# Altium project HVD F32.PrjPcb (part 1 of 2)
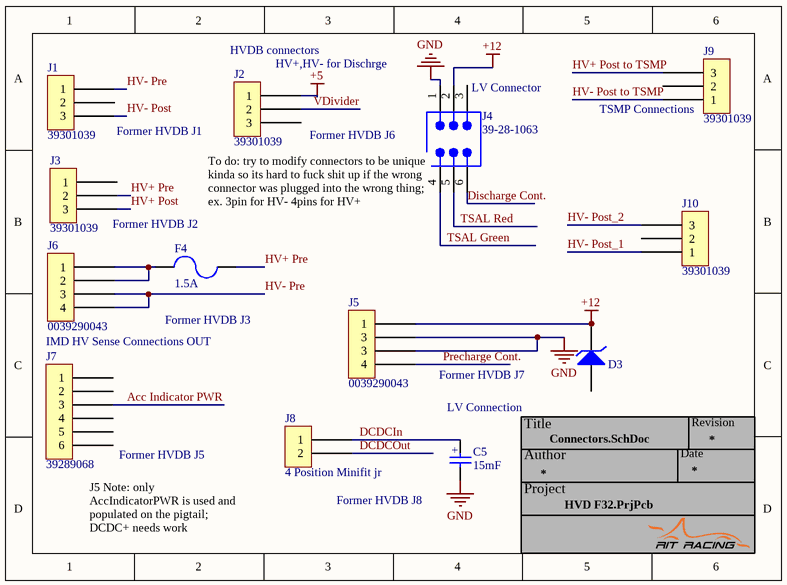
[diagram p0: Connectors.SchDoc]
4 sheets, 123 parts. Net scope: global (net labels, ports and power ports of the same name join across sheets).
Sheets:
  Connectors.SchDoc
  HVD.SchDoc
  external hvd schematic.SchDoc
  TSAL.SchDoc

## Sheet Connectors.SchDoc
size 146 x 107 mm; SheetNumber: 1; SheetTotal: 4

### Parts
(Parts that share a designator on the sheet are numbered #1, #2 ... from top to bottom, then left to right.)
C5#1  15mF  [158KXM050M]
D3  (no value)  [DO-214AC]
F4  1.5A  [048501.5DR]
J1  39301039  [39301039]
J2  39301039  [39301039]
J3  39301039  [39301039]
J4  39-28-1063  [MOLX-39-28-1063_V]
J5  0039290043  [0039290043]
J6  0039290043  [0039290043]
J7  39289068  [39289068]
J8  4 Position Minifit jr  [0010845040]
J9  39301039  [39301039]
J10  39301039  [39301039]

### Nets
+5: J2.1
+12: D3.2(K) J4.2 J5.1
GND: C5#1.2(Neg) J4.1 J5.2(3) J5.3
HV- Post: J1.3
HV- Post_1: J10.1
Acc Indicator PWR: J7.3
DCDCIn: C5#1.1(Pos) J8.1
DCDCOut: J8.2
Discharge Cont.: J4.6
HV+ Post: J3.3
HV+ Post to TSMP: J9.3
HV+ Pre: F4.2 J3.2
HV- Post to TSMP: J9.1
HV- Post_2: J10.3
HV- Pre: J1.1 J6.3 J6.4
Precharge Cont.: J5.4
TSAL Green: J4.4
TSAL Red: J4.5
VDivider: J2.2
NetF4_1: F4.1 J6.1 J6.2

Not connected (* = marked no-connect by the designer): D3 1(A); J1 2; J2 3; J3 1; J4 3; J7 1 2 4 5 6; J9 2; J10 2

### Notes on the sheet
- (near J2) HVDB connectors
- (near J2) HV+,HV- for Dischrge
- Former HVDB J1
- (near J4) LV Connector
- (near J9) TSMP Connections
- Former HVDB J6
- Former HVDB J2
- (near J4) To do: try to modify connectors to be unique kinda so its hard to fuck shit up if the wrong connector was plugged into the wrong thing; ex. 3pin for HV- 4pins for HV+
- (near F4) Former HVDB J3
- IMD HV Sense Connections OUT
- Former HVDB J7
- (near J7) Former HVDB J5
- (near C5#1) LV Connection
- Former HVDB J8
- (near J7) J5 Note: only AccIndicatorPWR is used and populated on the pigtail; DCDC+ needs work
- Title
- Author
- Date
- Revision
- Project
- (in symbol 158KXM050M) +

### Library data of the parts
C5#1 = 158KXM050M: 1.5mF Electrolytic
D3 = SMAJ16A: TVS Diode, SMD Mount, 16V Withstand, 17.8V Breakdown, 400W; TargetLibrary: RITRacing-Passives; MFG: Littlefuse; Publisher: T.Tallo; Published: 22Oct2016; Status: Active; PartNumber: SMAJ16A
F4 = 048501.5DR: 1.5A 600VDC Fuse, SMD Mount; Manufactuer: Littlefuse; TargetLibrary: RITRacing-Passives; Value: Value?; Publisher: T.Tallo; Published: 22Oct2016; Status: Active; Datasheet: https://www.littelfuse.com/~/media/electronics/datasheets/fuses/littelfuse_fuse_485_datasheet.pdf.pdf; Part Number: 048501.5DR
J1-J3 J9 J10 = 39301039: 3 Pin Minifit vertical
  J9: Supplier 1: Digi-Key; Supplier Part Number 1: WM18442-ND
J4 = CMP-1594-00001-1: 4.2 mm Pitch Mini-Fit Jr.Power Connector, Vertical, Through Hole, 6 Circuits, -40 to 105 degC, RoHS, Bag; Pitch: 4.2 mm; No. of Positions: 6; No. of Rows: 2; PartNumber: 39-28-1063; ComponentLink3Description: Package Specification; ComponentLink1URL: http://www.molex.com/; PackageVersion: Rev. F, 06/2009; Orientation: Vertical; ComponentLink3URL: http://www.molex.com/pdm_docs/sd/039281063_sd.pdf; ComponentLink2Description: Datasheet; PackageDescription: 6-Pin PCB Header, Vertical, Pitch 4.2 mm, Through Hole; ComponentLink1Description: Manufacturer URL; Temperature Min: -40 degC; RoHS: TRUE; Packing: Bag; Mounting Technology: Through Hole; Temperature Max: 105 degC; ComponentLink2URL: http://www.molex.com/webdocs/datasheets/pdf/en-us/0039281063_PCB_HEADERS.pdf
J5 J6 = 0039290043: Minifit jr 4 position
J8 = 0010845040

## Sheet HVD.SchDoc
size Letter; SheetNumber: 2; SheetTotal: 4
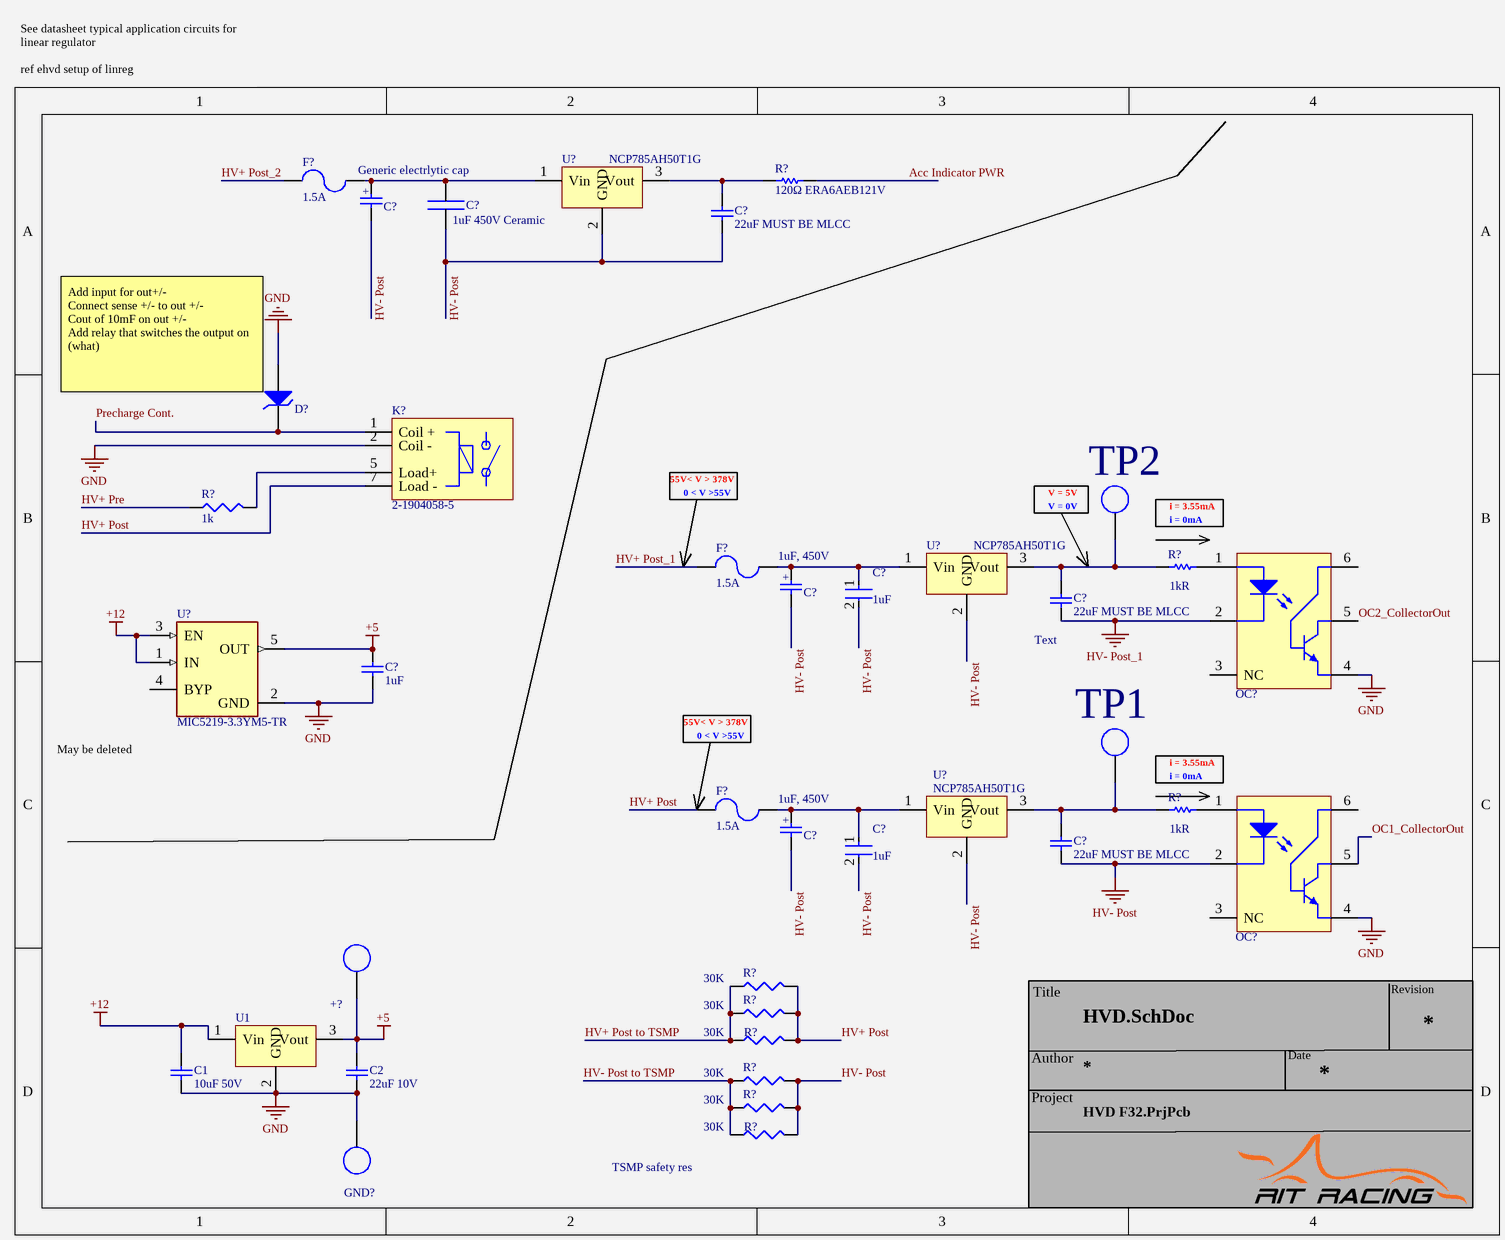
[diagram p1: HVD.SchDoc]

### Parts
(Parts that share a designator on the sheet are numbered #1, #2 ... from top to bottom, then left to right.)
+?  N/A  [PCB Test Point]  (value not drawn)
C1  10uF 50V  [CAPC2013X145X50LL20T25]
C2  22uF 10V  [CAPC2013X145X50LL20T25]
C?#1  Generic electrlytic cap  [Cap, TH, Electrolytic, 450V]
C?#2  1uF 450V Ceramic  [C5750X7T2W105K250KA]
C?#3  22uF MUST BE MLCC  [CAPC2013X145X50LL20T25]
C?#4  Capacitance: 1uF  [FP-GRM55D-0_4-IPC_A]  (hidden comment: 2220Y5000105KXTWS2)
C?#5  1uF, 450V  [Cap, TH, Electrolytic, 450V]
C?#6  22uF MUST BE MLCC  [CAPC2013X145X50LL20T25]
C?#7  1uF  [Cap, TH, Electrolytic]
C?#8  1uF, 450V  [Cap, TH, Electrolytic, 450V]
C?#9  Capacitance: 1uF  [FP-GRM55D-0_4-IPC_A]  (hidden comment: 2220Y5000105KXTWS2)
C?#10  22uF MUST BE MLCC  [CAPC2013X145X50LL20T25]
D?  (no value)  [DO-214AC]
F?#1  1.5A  [048501.5DR]
F?#2  1.5A  [048501.5DR]
F?#3  1.5A  [048501.5DR]
GND?  N/A  [PCB Test Point]  (value not drawn)
K?  2-1904058-5  [2-1904058-5]
OC?#1  CNY17-1  [DIP6]  (value not drawn)
OC?#2  CNY17-1  [DIP6]  (value not drawn)
R?#1  120Ω ERA6AEB121V  [RESC2013X60X40ML20T25]
R?#2  1k  [25W Wirewound Resistor, Chassis Mount]
R?#3  value 1kR  [RESC2013X70X40ML20T20]  (hidden comment: ERJ-6GEYJ102V)
R?#4  value 1kR  [RESC2013X70X40ML20T20]  (hidden comment: ERJ-6GEYJ102V)
R?#5  30K  [5329]
R?#6  30K  [5329]
R?#7  30K  [5329]
R?#8  30K  [5329]
R?#9  30K  [5329]
R?#10  30K  [5329]
TP1#1  N/A  [PCB Test Point]  (value not drawn)
TP2#1  N/A  [PCB Test Point]  (value not drawn)
U1  VXO7805-1000  [VXO7805-1000]  (value not drawn)
U?#1  NCP785AH50T1G  [SOT89]
U?#2  NCP785AH50T1G  [SOT89]
U?#3  MIC5219-3.3YM5-TR  [FP-SOT23-5LD-PL-1-IPC_C]
U?#4  NCP785AH50T1G  [SOT89]

### Nets
+5: +?.1 C2.1 C?#7.2(Neg) U1.3(Vout) U?#3.5(OUT)
+12: C1.1 U1.1(Vin) U?#3.1(IN) U?#3.3(EN)
GND: C1.2 C2.2 C?#7.1(Pos) D?.1(A) GND?.1 K?.2(Coil_-) OC?#1.4 OC?#2.4 U1.2(GND) U?#3.2(GND)
HV- Post: C?#1.2(Neg) C?#2.2 C?#3.2 C?#4.2 C?#5.2(Neg) C?#8.2(Neg) C?#9.2 C?#10.2 OC?#2.2(C) R?#8.2 R?#9.2 R?#10.2 U?#1.2(GND) U?#2.2(GND) U?#4.2(GND)
HV- Post_1: C?#6.2 OC?#1.2(C)
Acc Indicator PWR: R?#1.2
HV+ Post: F?#3.1 K?.7(Load_-) R?#5.2 R?#6.2 R?#7.2
HV+ Post to TSMP: R?#5.1 R?#6.1 R?#7.1
HV+ Post_1: F?#2.1
HV+ Post_2: F?#1.1
HV+ Pre: R?#2.1
HV- Post to TSMP: R?#8.1 R?#9.1 R?#10.1
OC1_CollectorOut: OC?#2.5
OC2_CollectorOut: OC?#1.5
Precharge Cont.: D?.2(K) K?.1(Coil_+)
NetC?#1_1: C?#1.1(Pos) C?#2.1 F?#1.2 U?#1.1(Vin)
NetC?#3_1: C?#3.1 R?#1.1 U?#1.3(Vout)
NetC?#4_1: C?#4.1 C?#5.1(Pos) F?#2.2 U?#2.1(Vin)
NetC?#6_1: C?#6.1 R?#3.1 TP2#1.1 U?#2.3(Vout)
NetC?#8_1: C?#8.1(Pos) C?#9.1 F?#3.2 U?#4.1(Vin)
NetC?#10_1: C?#10.1 R?#4.1 TP1#1.1 U?#4.3(Vout)
NetK?_5: K?.5(Load+) R?#2.2
NetOC?#1_1: OC?#1.1(A) R?#3.2
NetOC?#2_1: OC?#2.1(A) R?#4.2

Not connected (* = marked no-connect by the designer): OC?#1 3(NC) 6(Base); OC?#2 3(NC) 6(Base); U?#3 4(BYP)

### Notes on the sheet
- See datasheet typical application circuits for linear regulator
  ref ehvd setup of linreg
- (near D?) Add input for out+/-
  Connect sense +/- to out +/-
  Cout of 10mF on out +/-
  Add relay that switches the output on
  (what)
- 55V< V > 378V
- 0 < V >55V
- (near TP2#1) V = 5V
- (near TP2#1) V = 0V
- i = 3.55mA
- i = 0mA
- (near C?#6) Text
- (near U?#3) May be deleted
- (near R?#10) TSMP safety res
- Revision
- Title
- Date
- Author
- Project
- (in symbol Cap, TH Electrolytic 450V) +

### Library data of the parts
+? GND? TP1#1 TP2#1 = PCB Test Point: Manufacturer: RIT Racing; TargetLibrary: RITRacing-Connectors; PartNumber: N/A; Publisher: T.Tallo; Published: 22Oct2016; Status: Active; ComponentLink1URL: http://www.mouser.com/ds/2/215/005-5009-743680.pdf; ComponentLink1Description: Datasheet
C1 = CMP-1036-04746-2: Generic SMD Cap, 0805 Package; Manufacturer: Kemet; Part Number: C0805C105K4PACTU; Manufacturer 1: Samsung; Manufacturer Part Number 1: CL21A106KOQNNNE; Voltage Rating: 16V; Tolerance: 10%; Dielectric: X7R; Supplier 1: Digi-Key; Supplier Part Number 1: 1276-1096-1-ND; RoHS: Yes; Category: Ceramic Capacitors; Stock 1: 5707600; Pricing 1: 1=0.10000, 10=0.07400, 50=0.04040, 100=0.03300, 500=0.02354, 1000=0.01850 (USD); Mounting Technology: Surface Mount; Case/Package: 0805; Case Code (Metric): 2012; Case Code (Imperial): 0805; Min Operating Temperature: -55°C; Max Operating Temperature: 85°C; Package Quantity: 1; Packaging: Tape and Reel; Series: CL; Value: 10uF; Voltage Rating (DC): 16V; Voltage: 16V; Construction: Flat; Length: 2mm; Width: 0.049inch; Height: 1.25mm; Thickness: 0.055inch; Depth: 1.25mm; Radiation Hardening: No; RoHS Compliant: Yes; Lead Free: Lead Free; ComponentLink1URL: https://datasheet.ciiva.com/25798/cl21a106koqnnne-25798133.pdf?src-supplier=Digi-Key; ComponentLink1Description: https://datasheet.ciiva.com/25798/cl21a106koqnnne-25798133.pdf?src-supplier=Digi-Key; ComponentLink2URL: https://datasheet.ciiva.com/15216/getdatasheetpartid-358435-15216234.pdf?src-supplier=Verical; ComponentLink2Description: https://datasheet.ciiva.com/15216/getdatasheetpartid-358435-15216234.pdf?src-supplier=Verical; ComponentLink3URL: https://datasheet.ciiva.com/16740/cl05b104kq5nnnc-16740697.pdf?src-supplier=Future+Electronics; ComponentLink3Description: https://datasheet.ciiva.com/16740/cl05b104kq5nnnc-16740697.pdf?src-supplier=Future+Electronics
C2 = CMP-1036-04746-2: Generic SMD Cap, 0805 Package; Manufacturer 1: TDK; Manufacturer Part Number 1: C2012X5R1C226M125AC; Dielectric Material: Ceramic; Tolerance: 20%; Voltage Rating: 16V; Dielectric: X5R; Supplier 1: Digi-Key; Supplier Part Number 1: 445-7647-1-ND; RoHS: Yes; Category: Ceramic Capacitors; Stock 1: 149468; Pricing 1: 1=0.59000, 10=0.41400, 50=0.31320, 100=0.27270, 500=0.20200, 1000=0.17170 (USD); Mounting Technology: Surface Mount; Case/Package: 0805; Pins: 2; Case Code (Metric): 2012; Case Code (Imperial): 0805; Weight: 0.000194oz; Min Operating Temperature: -55°C; Max Operating Temperature: 85°C; Value: 22uF; Packaging: Tape and Reel; Package Quantity: 1; Voltage Rating (DC): 16V; Termination: SMD/SMT; Resistor Type: Ceramic; Series: C; Construction: Flat; Length: 2mm; Width: 0.049inch; Height: 1.25mm; Thickness: 0.057inch; Depth: 1.25mm; Radiation Hardening: No; Lead Free: Lead Free; RoHS Compliant: Yes; ComponentLink1URL: https://datasheet.ciiva.com/6252/tdkmlcccaprange-6252728.pdf?src-supplier=Digi-Key; ComponentLink1Description: https://datasheet.ciiva.com/6252/tdkmlcccaprange-6252728.pdf?src-supplier=Digi-Key; ComponentLink2URL: https://datasheet.ciiva.com/6252/tdkmlcccaprange-6252730.pdf?src-supplier=Digi-Key; ComponentLink2Description: https://datasheet.ciiva.com/6252/tdkmlcccaprange-6252730.pdf?src-supplier=Digi-Key; ComponentLink3URL: https://datasheet.ciiva.com/6252/tdkmlcccaprange-6252732.pdf?src-supplier=Digi-Key; ComponentLink3Description: https://datasheet.ciiva.com/6252/tdkmlcccaprange-6252732.pdf?src-supplier=Digi-Key; ComponentLink4URL: https://datasheet.ciiva.com/22725/1913358-22725560.pdf?src-supplier=Element14; ComponentLink4Description: https://datasheet.ciiva.com/22725/1913358-22725560.pdf?src-supplier=Element14; ComponentLink5URL: https://datasheet.ciiva.com/16449/e412-c-16449593.pdf?src-supplier=Future+Electronics; ComponentLink5Description: https://datasheet.ciiva.com/16449/e412-c-16449593.pdf?src-supplier=Future+Electronics
C?#1 C?#5 C?#8 = Cap, TH Electrolytic 450V: 8mmx3.5mm
  C?#5 C?#8: Supplier 1: Digi-Key; Supplier Part Number 1: 493-13563-1-ND
C?#2 = C5750X7T2W105K250KA: 1uF 450V Ceramic 2220
C?#3 C?#6 C?#10 = CMP-1036-04746-2: Generic SMD Cap, 0805 Package; Manufacturer: Kemet; Part Number: C0805C105K4PACTU
C?#4 C?#9 = CMP-2000-06370-2: 1 µF ±10% 500V Ceramic Capacitor X7R 2220 (5750 Metric); Voltage Rating (DC): 250V; Width: 5mm; Height: 2mm; Case Code (Imperial): 2220; Max Operating Temperature: 125°C; Number of Pins: 2; Min Operating Temperature: -55°C; Termination: SMD/SMT; Case/Package: 2220; Dielectric: X7R; Material: Ceramic; REACH SVHC: No SVHC; Voltage: 250V; Packaging: Tape and Reel; Thickness: 0.087inch; Depth: 5mm; Package Quantity: 1; Tolerance: 10%; Mount: Surface Mount; Voltage Rating: 250V; Length: 5.7mm; Case Code (Metric): 5750; Lead Free: Lead Free
C?#7 = Cap, TH, Electrolytic: Generic Cap, TH, Electrolytic; TargetLibrary: RITRacing-Passives; Value: Value?; Publisher: T.Tallo; Published: 22Oct2016; Status: Active
D? = SMAJ16A: as D3 on sheet Connectors; Publisher: T.Tallo; Published: 22Oct2016; Status: Active; PartNumber: SMAJ16A
F?#1-F?#3 = 048501.5DR: as F4 on sheet Connectors; Publisher: T.Tallo; Published: 22Oct2016; Status: Active; Datasheet: https://www.littelfuse.com/~/media/electronics/datasheets/fuses/littelfuse_fuse_485_datasheet.pdf.pdf; Part Number: 048501.5DR
  F?#2 F?#3: Supplier 1: Digi-Key; Supplier Part Number 1: F5922CT-ND
K? = 2-1904058-5: Mini-Precharge Relay, TH; Manufacturer: TE Connectivity; TargetLibrary: RITRacing-Relays_Switches; PartNumber: 2-1904058-5; Publisher: T.Tallo; Published: 20Oct2016; Status: Active; ComponentLink1URL: http://www.te.com/commerce/DocumentDelivery/DDEController?Action=showdoc&DocId=Data+Sheet%7FV23700-X0000-A001%7F1117%7Fpdf%7FEnglish%7FENG_DS_V23700-X0000-A001_1117.pdf%7F2-1904058-5; ComponentLink1Description: Datasheet
OC?#1 OC?#2 = CNY17-1: Optocoupler DC-IN 1-CH Transistor With Base DC-OUT 6-Pin PDIP Tube; Manufacturer: Vishay; TargetLibrary: RITRacing-Transistors; Number of Channels: 1; Collector Emitter Voltage (VCEO): 250mV; Output Current per Channel: 100mA; Isolation Voltage: 5kV; Max Power Dissipation: 150mW; Forward Voltage: 1.65V; Output Voltage: 70V; Collector Emitter Saturation Voltage: 400mV; Max Input Current: 60mA; Current Transfer Ratio: -80%; Rise Time: 2us; Input Type: DC; Reverse Breakdown Voltage: 5V; Fall Time: 11us; Voltage Rating (DC): 32V; Value: 25pF; Approvals: VDE; PartNumber: CNY17-1; Publisher: T.Tallo; Published: 24Dec2016; Status: Active; Supplier 1: Digi-Key; Supplier Part Number 1: CNY17-1.-ND; Manufacturer 1: Vishay; Manufacturer Part Number 1: CNY17-1; RoHS: Yes; Category: Optocouplers; Stock 1: 1397; Pricing 1: 1=0.66000, 10=0.43200, 100=0.28570, 1000=0.22056, 2000=0.19931, 5000=0.18602, 10000=0.17937, 25000=0.17672 (USD); Mounting Technology: Through Hole; Case/Package: DIP; Pins: 6; Min Operating Temperature: -55°C; Max Operating Temperature: 100°C; Packaging: Rail/Tube; Package Quantity: 2000; Max Output Voltage: 70V; Forward Current: 60mA; Collector-emitter Voltage-Max: 400mV; Max Collector Current: 100mA; Number of Elements: 1; Power Dissipation: 150mW; Input Current: 60mA; Collector Emitter Breakdown Voltage: 70V; Isolation Voltage-Max: 5kV; Radiation Hardening: No; Lead Free: Lead Free; RoHS Compliant: Yes; ComponentLink2URL: https://datasheet.ciiva.com/15118/getdatasheetpartid-74706-15118480.pdf?src-supplier=Verical; ComponentLink3URL: https://datasheet.ciiva.com/14146/cny17-eng-tds-14146953.pdf?src-supplier=Distrelec; ComponentLink3Description: https://datasheet.ciiva.com/14146/cny17-eng-tds-14146953.pdf?src-supplier=Distrelec; ComponentLink4URL: https://datasheet.ciiva.com/4111/29592200s462310n5680-4111008.pdf?src-supplier=Arrow+Electronics; ComponentLink4Description: https://datasheet.ciiva.com/4111/29592200s462310n5680-4111008.pdf?src-supplier=Arrow+Electronics; ComponentLink5URL: https://datasheet.ciiva.com/29301/153371-da-01-en-optocoupler-cny17-1-29301381.pdf?src-supplier=Conrad; ComponentLink5Description: https://datasheet.ciiva.com/29301/153371-da-01-en-optocoupler-cny17-1-29301381.pdf?src-supplier=Conrad; ComponentLink6URL: https://datasheet.ciiva.com/8085/cny17-8085017.pdf?src-supplier=Avnet; ComponentLink6Description: https://datasheet.ciiva.com/8085/cny17-8085017.pdf?src-supplier=Avnet; ComponentLink7URL: https://datasheet.ciiva.com/2086/s-110-cny17-2086327.pdf?src-supplier=Digi-Key; ComponentLink7Description: https://datasheet.ciiva.com/2086/s-110-cny17-2086327.pdf?src-supplier=Digi-Key; ComponentLink8URL: https://datasheet.ciiva.com/16429/cny17-16429671.pdf?src-supplier=Future+Electronics; ComponentLink8Description: https://datasheet.ciiva.com/16429/cny17-16429671.pdf?src-supplier=Future+Electronics
  OC?#1: ComponentLink2Description: Datasheet
  OC?#2: ComponentLink1URL: http://www.mouser.com/ds/2/427/sfh618a-241330.pdf; ComponentLink1Description: Datasheet; ComponentLink2Description: https://datasheet.ciiva.com/15118/getdatasheetpartid-74706-15118480.pdf?src-supplier=Verical
R?#1 = CMP-2001-00588-1: 1; Manufacturer: Panasonic; Part Number: ERA6AEB121V
R?#2 = HSA251K0J: 25W 1k Chassis Mount, Wirewound Resistor; TargetLibrary: RITRacing-Passives; Value: Value?; Publisher: T.Tallo; Published: 22Oct2016; Status: Active
R?#3 R?#4 = CMP-2001-00336-1: Manufacturer: Panasonic; Tolerance: 5%; Power Rating: 125mW; Voltage Rating: 150V; Temperature Coefficient: 200ppm/°C; Part Number: ERJ-6GEYJ102V; Supplier 1: Digi-Key; Supplier Part Number 1: P1.0KADKR-ND; Manufacturer 1: Panasonic; Manufacturer Part Number 1: ERJ-6GEYJ102V; RoHS: Yes; Category: Chip SMD Resistors; Stock 1: 741929; Pricing 1: 1=0.10000, 10=0.06800, 100=0.02780, 1000=0.01251, 2500=0.01086 (USD); Mounting Technology: Surface Mount; Case/Package: 0805; Case Code (Imperial): 0805; Case Code (Metric): 2012; Contact Plating: Tin; Min Operating Temperature: -55°C; Max Operating Temperature: 155°C; Packaging: Tape and Reel; Resistor Type: Thick Film; Number of Terminations: 2; Termination: SMD/SMT; Max Power Dissipation: 125mW; Series: ERJ; Resistance Tolerance: 5%; Package Quantity: 1; Voltage Rating (DC): 150V; Construction: Rectangular; Technology: THICK FILM; Length: 2mm; Width: 1.25mm; Height: 0.6mm; Depth: 1.25mm; Radiation Hardening: No; RoHS Compliant: Yes; Military Standard: Not; Lead Free: Lead Free; Reach SVHC Compliant: Yes; ComponentLink1URL: https://datasheet.ciiva.com/11808/0900766b80f806dd-11808499.pdf?src-supplier=Rs; ComponentLink1Description: https://datasheet.ciiva.com/11808/0900766b80f806dd-11808499.pdf?src-supplier=Rs; ComponentLink2URL: https://datasheet.ciiva.com/43460/1500035-43460108.pdf?src-supplier=Farnell; ComponentLink2Description: https://datasheet.ciiva.com/43460/1500035-43460108.pdf?src-supplier=Farnell; ComponentLink3URL: https://datasheet.ciiva.com/46386/1500035-46386460.pdf?src-supplier=Element14; ComponentLink3Description: https://datasheet.ciiva.com/46386/1500035-46386460.pdf?src-supplier=Element14; ComponentLink4URL: https://datasheet.ciiva.com/46371/1500035-46371933.pdf?src-supplier=Element14; ComponentLink4Description: https://datasheet.ciiva.com/46371/1500035-46371933.pdf?src-supplier=Element14; ComponentLink5URL: https://datasheet.ciiva.com/28532/1500035-28532142.pdf?src-supplier=Element14; ComponentLink5Description: https://datasheet.ciiva.com/28532/1500035-28532142.pdf?src-supplier=Element14; ComponentLink6URL: https://datasheet.ciiva.com/24026/aoa0000ce1-37422-24026920.pdf?src-supplier=Mouser; ComponentLink6Description: https://datasheet.ciiva.com/24026/aoa0000ce1-37422-24026920.pdf?src-supplier=Mouser; ComponentLink7URL: https://datasheet.ciiva.com/16788/70255313-16788493.pdf?src-supplier=Allied+Electronics; ComponentLink7Description: https://datasheet.ciiva.com/16788/70255313-16788493.pdf?src-supplier=Allied+Electronics; ComponentLink8URL: https://datasheet.ciiva.com/9117/aoa0000ce1-9117367.pdf?src-supplier=Avnet; ComponentLink8Description: https://datasheet.ciiva.com/9117/aoa0000ce1-9117367.pdf?src-supplier=Avnet; ComponentLink9URL: https://datasheet.ciiva.com/48532/aoa0000ce1-48532157.pdf?src-supplier=Avnet; ComponentLink9Description: https://datasheet.ciiva.com/48532/aoa0000ce1-48532157.pdf?src-supplier=Avnet; ComponentLink10URL: https://datasheet.ciiva.com/30074/4aoa0000ce1-30074261.pdf?src-supplier=Onlinecomponents.com; ComponentLink10Description: https://datasheet.ciiva.com/30074/4aoa0000ce1-30074261.pdf?src-supplier=Onlinecomponents.com
R?#5-R?#10 = SMF530KJT: Res Metal Film 30K Ohm 5% 5W ±100ppm/°C Molded J-Lead SMD T/R; Manufacturer 1: TE Connectivity Holsworthy; TargetLibrary: RITRacing-Passives; MFG: TE Connectivity; Voltage Rating: 500V; Number of Resistors: 1; Publisher: T.Tallo; Published: 22Oct2016; Status: Active; Value: 30K; Datasheet: https://www.mouser.com/datasheet/2/418/5/ENG_DS_1773242_F-732267.pdf; Supplier 1: Digi-Key; Supplier Part Number 1: A138700CT-ND; Manufacturer Part Number 1: SMF530KJT; RoHS: Yes; Category: Chip SMD Resistors; Stock 1: 804; Pricing 1: 1=1.10000, 10=0.97100, 25=0.89280, 50=0.81460, 100=0.70500, 250=0.59532 (USD); Mounting Technology: Surface Mount; Case/Package: SMD/SMT; Min Operating Temperature: -80°C; Max Operating Temperature: 280°C; Power Rating: 5W; Tolerance: 5%; Resistor Type: Power resistor; Packaging: Tape and Reel; Temperature Coefficient: 100ppm/°C; Voltage Rating (DC): 500V; Number of Terminations: 2; Resistance Tolerance: 5%; Features: Flame Retardant Coating; Series: SMF, CGS; Max Power Dissipation: 5W; Termination: Solder; Technology: METAL FILM; Length: 13.5mm; Height: 6.8mm; Depth: 7.3mm; Reach SVHC Compliant: Yes; RoHS Compliant: Yes; ELV: Compliant; ComponentLink1URL: http://www.farnell.com/datasheets/1572268.pdf?src-supplier=Farnell; ComponentLink1Description: http://www.farnell.com/datasheets/1572268.pdf?src-supplier=Farnell; ComponentLink2URL: http://www.mouser.com/ds/2/418/NG_DS_1773242_E-732267.pdf?src-supplier=Mouser; ComponentLink2Description: http://www.mouser.com/ds/2/418/NG_DS_1773242_E-732267.pdf?src-supplier=Mouser; ComponentLink3URL: http://uk.rs-online.com/webdocs/12d5/0900766b812d5acc.pdf?src-supplier=Rs; ComponentLink3Description: http://uk.rs-online.com/webdocs/12d5/0900766b812d5acc.pdf?src-supplier=Rs; ComponentLink4URL: http://www.farnell.com/datasheets/1572268.pdf?src-supplier=Element14; ComponentLink4Description: http://www.farnell.com/datasheets/1572268.pdf?src-supplier=Element14; ComponentLink5URL: https://www.te.com/commerce/DocumentDelivery/DDEController?Action=srchrtrv&amp;DocNm=1773242&amp;DocType=DS&amp;DocLang=English&src-supplier=Digi-Key; ComponentLink5Description: https://www.te.com/commerce/DocumentDelivery/DDEController?Action=srchrtrv&amp;DocNm=1773242&amp;DocType=DS&amp;DocLang=English&src-supplier=Digi-Key
U1 = VXO7805-1000: 8-27V IN, 5V OUT, Swithing Regulator, 1A; Manufacturer: On Semi; TargetLibrary: CUI; PartNumber: VXO7805-1000; Publisher: T.Tallo; Published: 27Oct2016; Status: Active; ComponentLink1URL: http://www.mouser.com/ds/2/268/20005399A-909415.pdf; ComponentLink1Description: Datasheet; Supplier 1: Digi-Key; Supplier Part Number 1: 102-4258-ND
U?#1 U?#2 U?#4 = NCP785AH50T1G: Linear Reg. 55V-450V IN, 5V OUT; Manufacturer: On Semi; TargetLibrary: RITRacing-ICs; PartNumber: NCP785AH50T1G; Publisher: T.Tallo; Published: 27Oct2016; Status: Active; ComponentLink1URL: http://www.mouser.com/ds/2/268/20005399A-909415.pdf; ComponentLink1Description: Datasheet
  U?#2 U?#4: Supplier 1: Newark; Supplier Part Number 1: 50AC6348; Supplier 2: Digi-Key; Supplier Part Number 2: NCP785AH50T1GOSDKR-ND
U?#3 = CMP-06324-000027-1: IC REG LINEAR 3.3V 500MA SOT23-5; Dropout Voltage: 350mV; Output Type: Fixed; Number of Regulators: 1; Max Input Voltage: 12V; Min Input Voltage: 2.5V; Min Operating Temperature: -40°C; Nominal Output Voltage: 3.3V; Output Voltage: 3.3V; Packaging: Cut Tape; Mount: Surface Mount; Number of Pins: 5; Case/Package: SOT-23-5; Lead Free: Lead Free; Max Operating Temperature: 125°C; REACH SVHC: No SVHC; Output Current: 500mA